# Altium project rad_detector_v500.PrjPcb
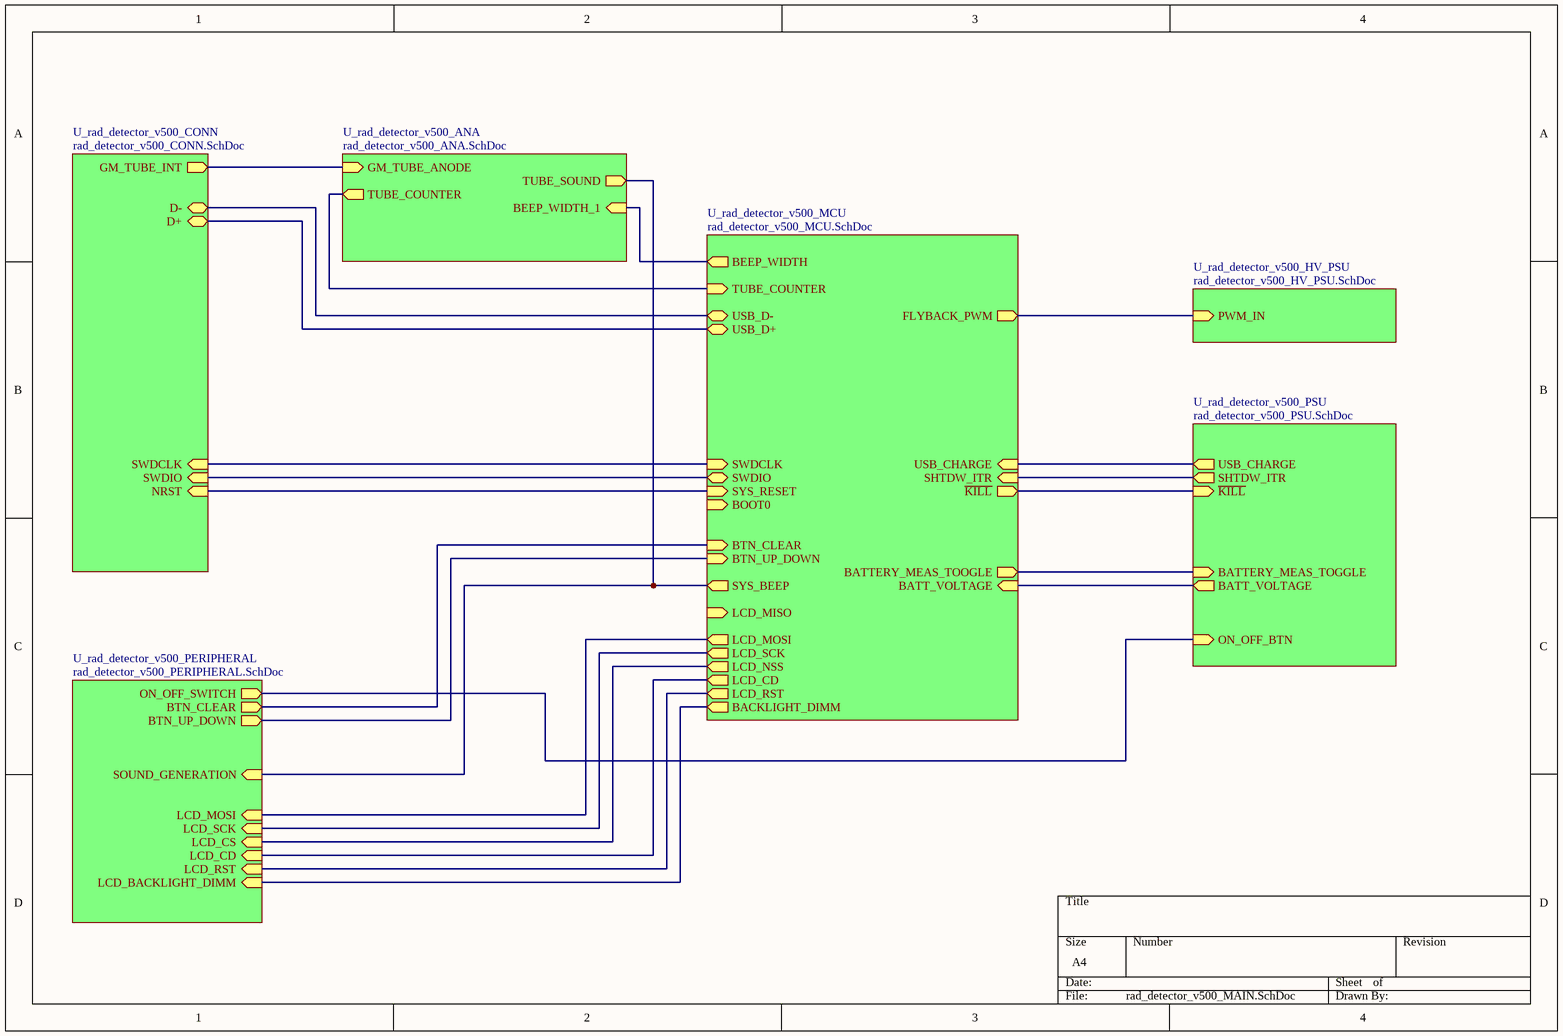
[diagram p0: rad_detector_v500_MAIN.SchDoc]
7 sheets, 104 parts. Net scope: hierarchical (ports join the sheet entries above them; power ports are global).
Board file: rad_detector_v500.PcbDoc
Sheets:
  rad_detector_v500_MAIN.SchDoc
    U_rad_detector_v500_CONN = rad_detector_v500_CONN.SchDoc
    U_rad_detector_v500_PERIPHERAL = rad_detector_v500_PERIPHERAL.SchDoc
    U_rad_detector_v500_ANA = rad_detector_v500_ANA.SchDoc
    U_rad_detector_v500_HV_PSU = rad_detector_v500_HV_PSU.SchDoc
    U_rad_detector_v500_PSU = rad_detector_v500_PSU.SchDoc
    U_rad_detector_v500_MCU = rad_detector_v500_MCU.SchDoc

## Sheet rad_detector_v500_MAIN.SchDoc
size A4; SheetNumber: 1; SheetTotal: 7

### Sub-sheets
U_rad_detector_v500_ANA = rad_detector_v500_ANA.SchDoc: GM_TUBE_ANODE (in), BEEP_WIDTH_1 (in), TUBE_COUNTER (out), TUBE_SOUND (out)
U_rad_detector_v500_CONN = rad_detector_v500_CONN.SchDoc: GM_TUBE_INT (out), D- (bidir), D+ (bidir), NRST (in), SWDCLK (in), SWDIO (in)
U_rad_detector_v500_HV_PSU = rad_detector_v500_HV_PSU.SchDoc: PWM_IN (in)
U_rad_detector_v500_MCU = rad_detector_v500_MCU.SchDoc: SYS_BEEP (out), BOOT0 (in), SYS_RESET (in), SWDIO (bidir), SWDCLK (in), USB_CHARGE (in), BATTERY_MEAS_TOOGLE (out), FLYBACK_PWM (out), SHTDW_ITR (in), TUBE_COUNTER (in), BACKLIGHT_DIMM (out), LCD_RST (out), LCD_MOSI (out), LCD_MISO (in), LCD_SCK (out), LCD_NSS (out), USB_D- (bidir), USB_D+ (bidir), BTN_CLEAR (in), BTN_UP_DOWN (in), BATT_VOLTAGE (in), BEEP_WIDTH (out), ~{KILL} (out), LCD_CD (out)
U_rad_detector_v500_PERIPHERAL = rad_detector_v500_PERIPHERAL.SchDoc: SOUND_GENERATION (in), LCD_BACKLIGHT_DIMM (in), LCD_MOSI (in), LCD_SCK (in), LCD_CS (in), LCD_CD (in), LCD_RST (in), ON_OFF_SWITCH (out), BTN_CLEAR (out), BTN_UP_DOWN (out)
U_rad_detector_v500_PSU = rad_detector_v500_PSU.SchDoc: ON_OFF_BTN (in), SHTDW_ITR (out), USB_CHARGE (out), BATTERY_MEAS_TOGGLE (in), BATT_VOLTAGE (out), ~{KILL} (in)

### Nets
BACKLIGHT_DIMM: sheet U_rad_detector_v500_PERIPHERAL/LCD_BACKLIGHT_DIMM, sheet U_rad_detector_v500_MCU/BACKLIGHT_DIMM
BTN_CLEAR: sheet U_rad_detector_v500_PERIPHERAL/BTN_CLEAR, sheet U_rad_detector_v500_MCU/BTN_CLEAR
BTN_UP_DOWN: sheet U_rad_detector_v500_PERIPHERAL/BTN_UP_DOWN, sheet U_rad_detector_v500_MCU/BTN_UP_DOWN
LCD_CD: sheet U_rad_detector_v500_PERIPHERAL/LCD_CD, sheet U_rad_detector_v500_MCU/LCD_CD
LCD_CS: sheet U_rad_detector_v500_PERIPHERAL/LCD_CS, sheet U_rad_detector_v500_MCU/LCD_NSS
LCD_MOSI: sheet U_rad_detector_v500_PERIPHERAL/LCD_MOSI, sheet U_rad_detector_v500_MCU/LCD_MOSI
LCD_RST: sheet U_rad_detector_v500_PERIPHERAL/LCD_RST, sheet U_rad_detector_v500_MCU/LCD_RST
LCD_SCK: sheet U_rad_detector_v500_PERIPHERAL/LCD_SCK, sheet U_rad_detector_v500_MCU/LCD_SCK
ON_OFF: sheet U_rad_detector_v500_PERIPHERAL/ON_OFF_SWITCH, sheet U_rad_detector_v500_PSU/ON_OFF_BTN
SWDCLK: sheet U_rad_detector_v500_CONN/SWDCLK, sheet U_rad_detector_v500_MCU/SWDCLK
SWDIO: sheet U_rad_detector_v500_CONN/SWDIO, sheet U_rad_detector_v500_MCU/SWDIO
SYS_RESET: sheet U_rad_detector_v500_CONN/NRST, sheet U_rad_detector_v500_MCU/SYS_RESET
USB_D+: sheet U_rad_detector_v500_CONN/D+, sheet U_rad_detector_v500_MCU/USB_D+
USB_D-: sheet U_rad_detector_v500_CONN/D-, sheet U_rad_detector_v500_MCU/USB_D-
NetC31_1: sheet U_rad_detector_v500_CONN/GM_TUBE_INT, sheet U_rad_detector_v500_ANA/GM_TUBE_ANODE
NetD4_1: sheet U_rad_detector_v500_PERIPHERAL/SOUND_GENERATION, sheet U_rad_detector_v500_ANA/TUBE_SOUND, sheet U_rad_detector_v500_MCU/SYS_BEEP
NetR7_2: sheet U_rad_detector_v500_HV_PSU/PWM_IN, sheet U_rad_detector_v500_MCU/FLYBACK_PWM
NetR11_1: sheet U_rad_detector_v500_PSU/USB_CHARGE, sheet U_rad_detector_v500_MCU/USB_CHARGE
NetR15_1: sheet U_rad_detector_v500_PSU/BATT_VOLTAGE, sheet U_rad_detector_v500_MCU/BATT_VOLTAGE
NetR16_2: sheet U_rad_detector_v500_PSU/BATTERY_MEAS_TOGGLE, sheet U_rad_detector_v500_MCU/BATTERY_MEAS_TOOGLE
NetR18_1: sheet U_rad_detector_v500_PSU/SHTDW_ITR, sheet U_rad_detector_v500_MCU/SHTDW_ITR
NetR48_1: sheet U_rad_detector_v500_ANA/BEEP_WIDTH_1, sheet U_rad_detector_v500_MCU/BEEP_WIDTH
NetR58_2: sheet U_rad_detector_v500_ANA/TUBE_COUNTER, sheet U_rad_detector_v500_MCU/TUBE_COUNTER
NetU5_2: sheet U_rad_detector_v500_PSU/~{KILL}, sheet U_rad_detector_v500_MCU/~{KILL}

## Sheet rad_detector_v500_CONN.SchDoc
size A4; SheetNumber: 5; SheetTotal: 7
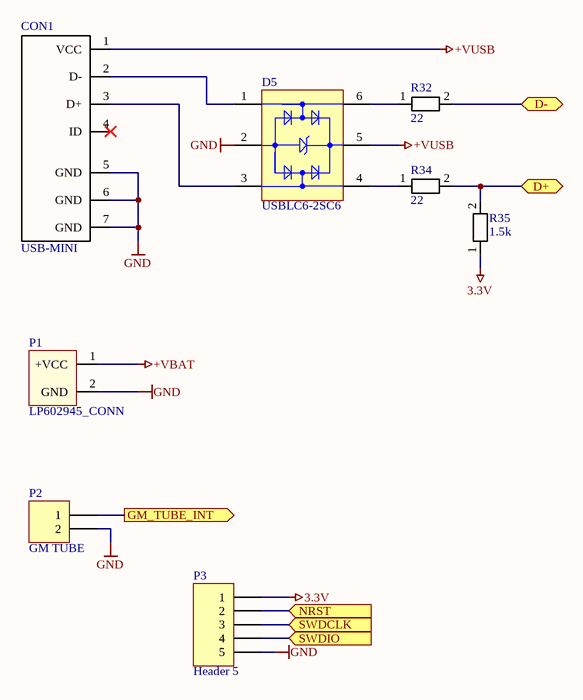
[diagram p1: rad_detector_v500_CONN.SchDoc]

### Parts
CON1  USB-MINI  [USB-MINI]
D5  USBLC6-2SC6  [STM-SOT23-6L_V]
P1  LP602945_CONN  [LP602945_CONN]
P2  GM TUBE  [HDR1X2]
P3  Header 5  [HDR1X5]
R32  22  [0805]
R34  22  [0805]
R35  1.5k  [0805]

### Ports
D+ (bidir, see rad_detector_v500_MAIN[1A]), D- (bidir, see rad_detector_v500_MAIN[1A]), GM_TUBE_INT (out, see rad_detector_v500_MAIN[1A]), NRST (in, see rad_detector_v500_MAIN[1B]), SWDCLK (in, see rad_detector_v500_MAIN[1B], rad_detector_v500_MCU[2C]), SWDIO (in, see rad_detector_v500_MAIN[1B], rad_detector_v500_MCU[2C])

### Nets
3.3V: P3.1 R35.1
+VBAT: P1.1(+VCC)
+VUSB: CON1.1(VCC) D5.5(VBUS)
GND: CON1.5(GND) CON1.6(GND) CON1.7(GND) D5.2(GND) P1.2(GND) P2.2 P3.5
SWDCLK: P3.3 ; port SWDCLK
SWDIO: P3.4 ; port SWDIO
SYS_RESET: P3.2 ; port NRST
USB_D+: R34.2 R35.2 ; port D+
USB_D-: R32.2 ; port D-
NetC31_1: P2.1 ; port GM_TUBE_INT
NetCON1_2: CON1.2(D-) D5.1(I/O_1)
NetCON1_3: CON1.3(D+) D5.3(I/O_2)
NetD5_4: D5.4(I/O_3) R34.1
NetD5_6: D5.6(I/O_4) R32.1

Not connected (* = marked no-connect by the designer): CON1 4(ID)*

### Library data of the parts
D5 = USBLC6-2SC6: Very low capacitance ESD protection, 3.5 pF, -40 to 125 degC, 6-Pin SOT23, RoHS, Tape and Reel; Manufacturer: STMicroelectronics; Polarity: Uni-Directional; Clamping Voltage: 17V; Rad Hardened: No; Product Height (mm): 1.3mm; Leakage Current (Max): 0.15uA; Product Length (mm): 3.05mm; Number of Elements: 1; Peak Pulse Current: 5A; Configuration: Dual; Reverse Breakdown Voltage: 6V; Working Voltage (Max): 5V; Capacitance Value: 3.5pF; Suppressor Type: DiodeArrays; Product Depth (mm): 1.75mm; Test Current (It): 1mA; Package / Case: SOT-23; Operating Temperature Max Deg. C: 125C; Package Description: 6-Pin Small Outline Transistor, Body 2.925 x 1.625 mm, Pitch 0.95 mm; Package Reference: SOT23-6L; Datasheet Version: Rev. 5, 10/2011; Operating Temperature Min Deg. C: -40C; Mounting Style: SurfaceMount; Direction Type: Uni-Directional; Mounting: SurfaceMount; Pin Count: 6; Leakage Current: 0.15uA; Packaging: TapeandReel; Operating Temperature Classification: Automotive; Clamping Voltage (Max): 17V; Manufacturer URL: http://www.st.com/; Reverse Stand-off Voltage: 5V; Datasheet URL: http://www.st.com/st-web-ui/static/active/en/resource/technical/document/datasheet/CD00050750.pdf; Working Voltage: 5V; Operating Temp Range: -40Cto125C
P2 = Header 2: Header, 2-Pin; LatestRevisionDate: 17-Jul-2002; LatestRevisionNote: Re-released for DXP Platform.; Publisher: Altium Limited
P3 = Header 5: Header, 5-Pin; LatestRevisionDate: 17-Jul-2002; LatestRevisionNote: Re-released for DXP Platform.; Publisher: Altium Limited
R32 R34 R35 = RESISTOR: Parameter 1: 10k

## Sheet rad_detector_v500_PERIPHERAL.SchDoc
size A4; SheetNumber: 6; SheetTotal: 7
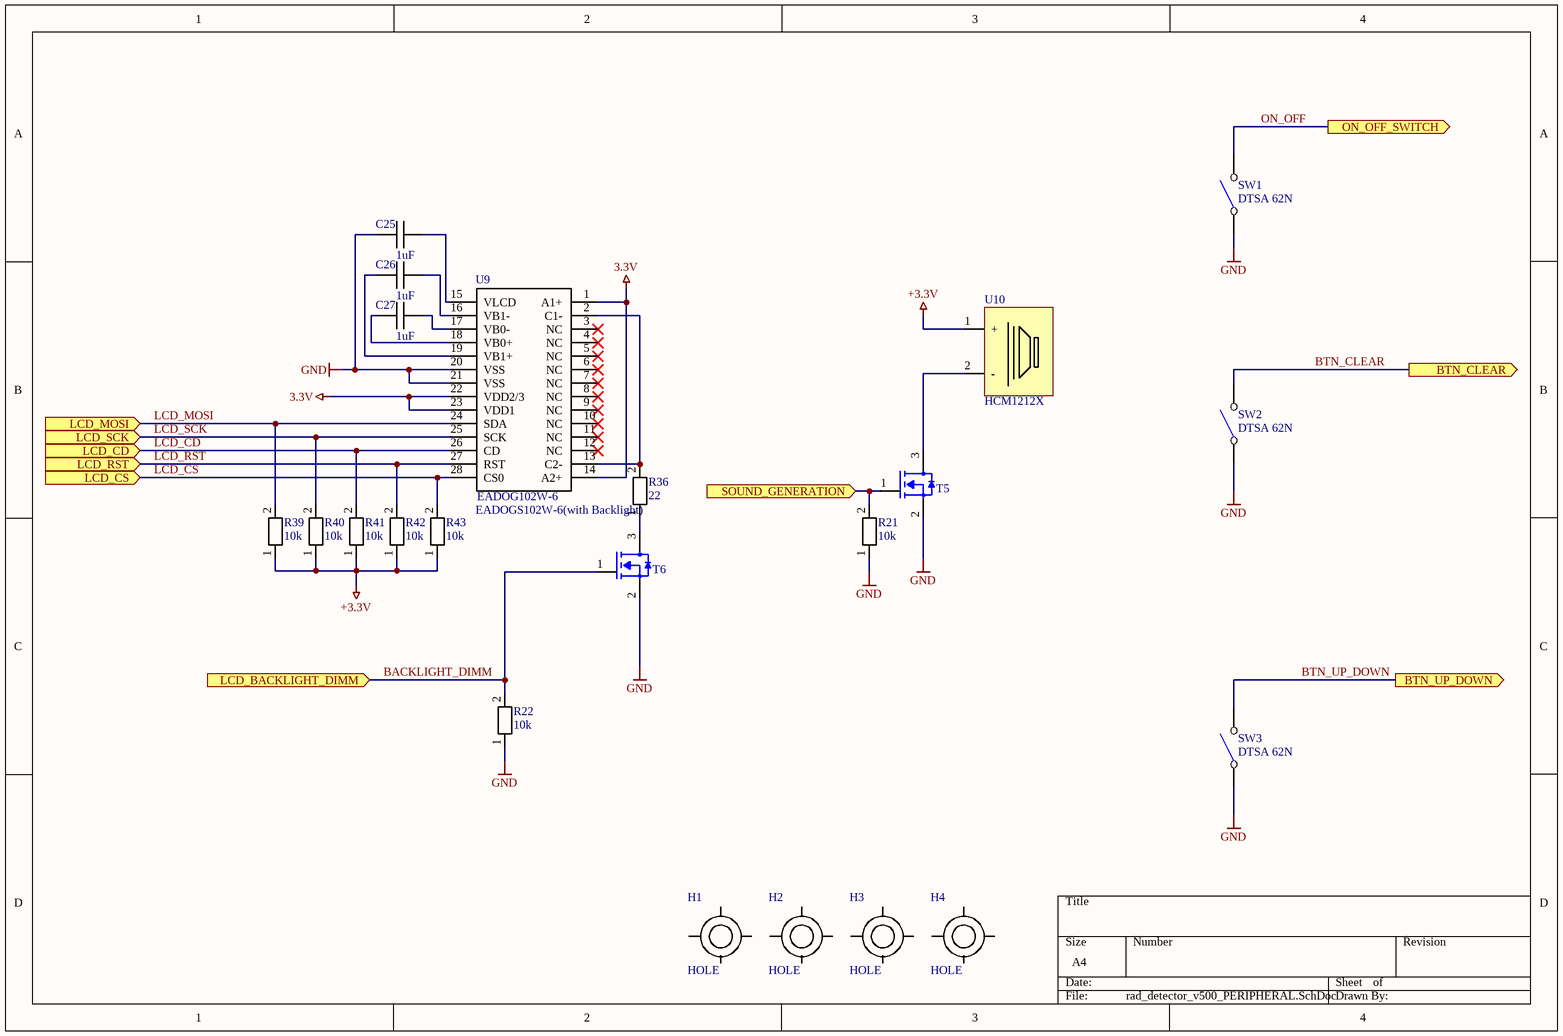
[diagram p2: rad_detector_v500_PERIPHERAL.SchDoc]

### Parts
C25  1uF  [0805_C]
C26  1uF  [0805_C]
C27  1uF  [0805_C]
H1  HOLE  [HOLE_140_160MIL]
H2  HOLE  [HOLE_140_160MIL]
H3  HOLE  [HOLE_140_160MIL]
H4  HOLE  [HOLE_140_160MIL]
R21  10k  [0805]
R22  10k  [0805]
R36  22  [1206]
R39  10k  [0805]
R40  10k  [0805]
R41  10k  [0805]
R42  10k  [0805]
R43  10k  [0805]
SW1  DTSA 62N  [SW_DTSA-62N]
SW2  DTSA 62N  [SW_DTSA-62N]
SW3  DTSA 62N  [SW_DTSA-62N]
T5  MMBF170  [SOT23]  (value not drawn)
T6  MMBF170  [SOT23]  (value not drawn)
U9  EADOGS102W-6(with Backlight)  [EADOGS102-6W]
U10  HCM1212X  [HCM1212X]

### Ports
BTN_CLEAR (out, see rad_detector_v500_MAIN[1C], rad_detector_v500_MCU[2B]), BTN_UP_DOWN (out, see rad_detector_v500_MAIN[1C], rad_detector_v500_MCU[2B]), LCD_BACKLIGHT_DIMM (in, see rad_detector_v500_MAIN[1D]), LCD_CD (in, see rad_detector_v500_MAIN[1D], rad_detector_v500_MCU[2C]), LCD_CS (in, see rad_detector_v500_MAIN[1D]), LCD_MOSI (in, see rad_detector_v500_MAIN[1D], rad_detector_v500_MCU[3C]), LCD_RST (in, see rad_detector_v500_MAIN[1D], rad_detector_v500_MCU[2C]), LCD_SCK (in, see rad_detector_v500_MAIN[1D], rad_detector_v500_MCU[3C]), ON_OFF_SWITCH (out, see rad_detector_v500_MAIN[1C]), SOUND_GENERATION (in, see rad_detector_v500_MAIN[1D])

### Nets
3.3V: U9.1(A1+) U9.14(A2+) U9.22(VDD2/3) U9.23(VDD1)
+3.3V: R39.1 R40.1 R41.1 R42.1 R43.1 U10.1(+)
GND: C25.1 R21.1 R22.1 SW1.1 SW2.1 SW3.1 T5.2(Source) T6.2(Source) U9.20(VSS) U9.21(VSS)
BACKLIGHT_DIMM: R22.2 T6.1(Gate) ; port LCD_BACKLIGHT_DIMM
BTN_CLEAR: SW2.2 ; port BTN_CLEAR
BTN_UP_DOWN: SW3.2 ; port BTN_UP_DOWN
LCD_CD: R41.2 U9.26(CD) ; port LCD_CD
LCD_CS: R43.2 U9.28(CS0) ; port LCD_CS
LCD_MOSI: R39.2 U9.24(SDA) ; port LCD_MOSI
LCD_RST: R42.2 U9.27(RST) ; port LCD_RST
LCD_SCK: R40.2 U9.25(SCK) ; port LCD_SCK
ON_OFF: SW1.2 ; port ON_OFF_SWITCH
NetC25_2: C25.2 U9.15(VLCD)
NetC26_1: C26.1 U9.19(VB1+)
NetC26_2: C26.2 U9.16(VB1-)
NetC27_1: C27.1 U9.18(VB0+)
NetC27_2: C27.2 U9.17(VB0-)
NetD4_1: R21.2 T5.1(Gate) ; port SOUND_GENERATION
NetR36_1: R36.1 T6.3(Drain)
NetR36_2: R36.2 U9.2(C1-) U9.13(C2-)
NetT5_3: T5.3(Drain) U10.2(-)

Not connected (* = marked no-connect by the designer): U9 3(NC)* 4(NC)* 5(NC)* 6(NC)* 7(NC)* 8(NC)* 9(NC)* 10(NC)* 11(NC)* 12(NC)*

### Notes on the sheet
- (in symbol EADOGS102W-6(with Backlight)) EADOG102W-6

### Library data of the parts
C25-C27 = CAPACITOR
R21 R22 R39-R43 = RESISTOR: Parameter 1: 10k
R36 = RESISTOR: Parameter 1: 10k
SW1-SW3 = SW_DTSA 62N
T5 T6 = MMBF170: N MOSFET

## Sheet rad_detector_v500_ANA.SchDoc
size A4; SheetNumber: 7; SheetTotal: 7
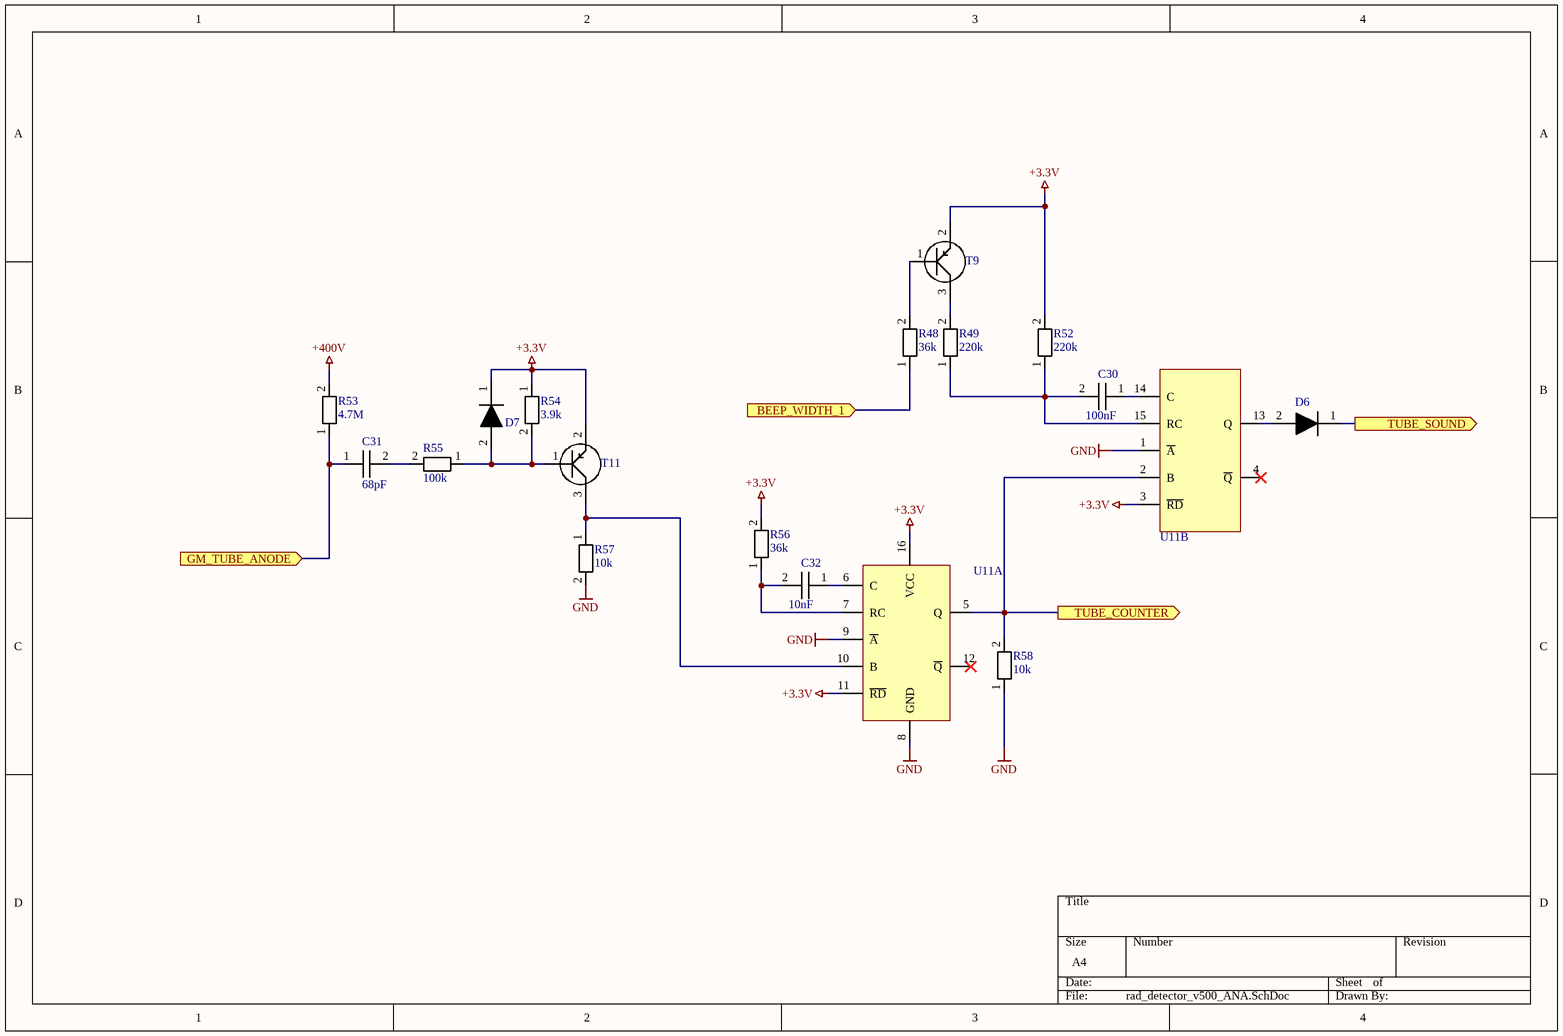
[diagram p3: rad_detector_v500_ANA.SchDoc]

### Parts
C30  100nF  [0805_C]
C31  68pF  [CAPACITOR_250MIL]
C32  10nF  [0805_C]
D6  DIODE  [SMD_DIODE_SOD80]  (value not drawn)
D7  DIODE  [SMD_DIODE_SOD80]  (value not drawn)
R48  36k  [0805]
R49  220k  [0805]
R52  220k  [0805]
R53  4.7M  [0805]
R54  3.9k  [0805]
R55  100k  [0805]
R56  36k  [0805]
R57  10k  [0805]
R58  10k  [0805]
T9  BC856  [SOT23]  (value not drawn)
T11  BC856  [SOT23]  (value not drawn)
U11  74HCT123  [74HCT123]  (value not drawn)  (parts A,B of 2)

### Ports
BEEP_WIDTH_1 (in, see rad_detector_v500_MAIN[2A]), GM_TUBE_ANODE (in, see rad_detector_v500_MAIN[1A]), TUBE_COUNTER (out, see rad_detector_v500_MAIN[1A], rad_detector_v500_MCU[2B]), TUBE_SOUND (out, see rad_detector_v500_MAIN[2A])

### Nets
+3.3V: D7.1 R52.2 R54.1 R56.2 T9.2 T11.2 U11.3(~{RD}) U11.11(~{RD}) U11.16(VCC)
+400V: R53.2
GND: R57.2 R58.1 U11.1(~{A}) U11.8(GND) U11.9(~{A})
NetC30_1: C30.1 U11.14(C)
NetC30_2: C30.2 R49.1 R52.1 U11.15(RC)
NetC31_1: C31.1 R53.1 ; port GM_TUBE_ANODE
NetC31_2: C31.2 R55.2
NetC32_1: C32.1 U11.6(C)
NetC32_2: C32.2 R56.1 U11.7(RC)
NetD4_1: D6.1 ; port TUBE_SOUND
NetD6_2: D6.2 U11.13(Q)
NetD7_2: D7.2 R54.2 R55.1 T11.1
NetR48_1: R48.1 ; port BEEP_WIDTH_1
NetR48_2: R48.2 T9.1
NetR49_2: R49.2 T9.3
NetR57_1: R57.1 T11.3 U11.10(B)
NetR58_2: R58.2 U11.2(B) U11.5(Q) ; port TUBE_COUNTER

Not connected (* = marked no-connect by the designer): U11 4(~{Q})* 12(~{Q})*

### Library data of the parts
C30-C32 = CAPACITOR
R48 R49 R52-R56 = RESISTOR: Parameter 1: 10k
R57 R58 = RESISTOR: Parameter 1: 10k
T9 T11 = TRANSISTOR_PNP

## Sheet rad_detector_v500_HV_PSU.SchDoc
size A4; SheetNumber: 2; SheetTotal: 7
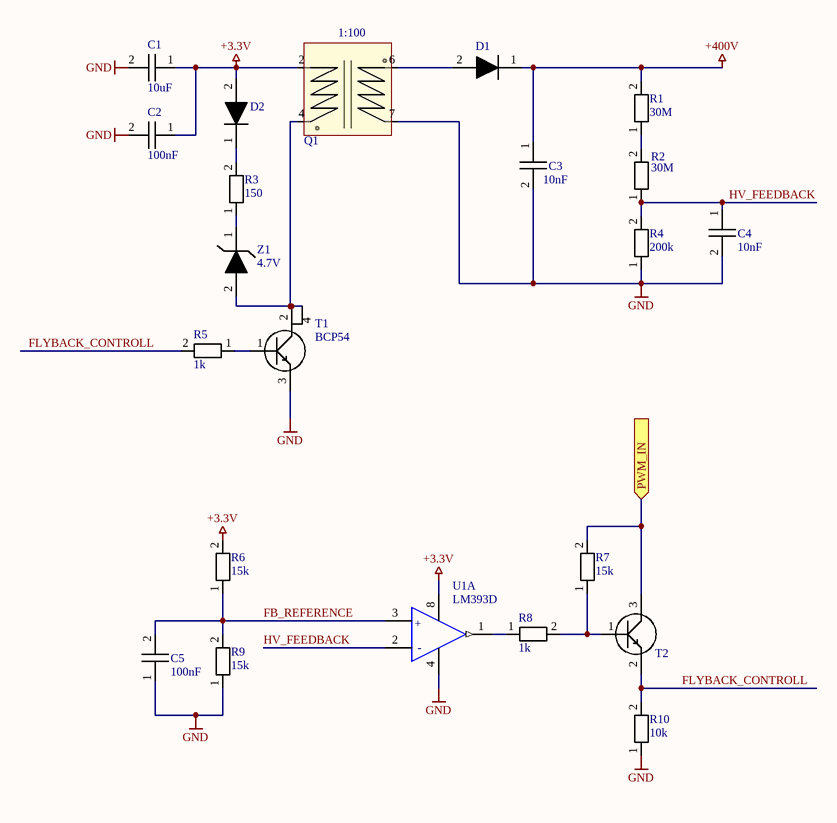
[diagram p4: rad_detector_v500_HV_PSU.SchDoc]

### Parts
C1  10uF  [1210_C]
C2  100nF  [0805_C]
C3  10nF  [CAPACITOR_300MIL]
C4  10nF  [0805_C]
C5  100nF  [0805_C]
D1  DIODE  [DIODE_400MIL]  (value not drawn)
D2  DIODE  [SMD_DIODE_SOD80]  (value not drawn)
Q1  DARFON_CCFL_TRANSFORMER  [DARFON_CCFL_TRANSFORMER]  (value not drawn)
R1  30M  [0805]
R2  30M  [0805]
R3  150  [0805]
R4  200k  [0805]
R5  1k  [0805]
R6  15k  [0805]
R7  15k  [0805]
R8  1k  [0805]
R9  15k  [0805]
R10  10k  [0805]
T1  BCP54  [SOT233-1]
T2  BC848*  [SOT23]  (value not drawn)
U1  LM393D  [SO-8]  (part A of 2)
Z1  4.7V  [SMD_DIODE_SOD80]

### Ports
PWM_IN (in, see rad_detector_v500_MAIN[4B])

### Nets
+3.3V: C1.1 C2.1 D2.2 Q1.2 R6.2 U1.8(Vcc+)
+400V: C3.1 D1.1 R1.2
GND: C1.2 C2.2 C3.2 C4.2 C5.1 Q1.7 R4.1 R9.1 R10.1 T1.3 U1.4(Vcc-)
FB_REFERENCE: C5.2 R6.1 R9.2 U1.3(In1+)
FLYBACK_CONTROLL: R5.2 R10.2 T2.2
HV_FEEDBACK: C4.1 R2.1 R4.2 U1.2(In1-)
NetD1_2: D1.2 Q1.6
NetD2_1: D2.1 R3.2
NetQ1_4: Q1.4 T1.2 T1.4 Z1.2
NetR1_1: R1.1 R2.2
NetR3_1: R3.1 Z1.1
NetR5_1: R5.1 T1.1
NetR7_1: R7.1 R8.2 T2.1
NetR7_2: R7.2 T2.3 ; port PWM_IN
NetR8_1: R8.1 U1.1(Out1)

### Notes on the sheet
- (in symbol DARFON_CCFL_TRANSFORMER) 1:100
- (in symbol LM393D, part A) +; -

### Library data of the parts
C1-C5 = CAPACITOR
R1-R9 = RESISTOR: Parameter 1: 10k
R10 = RESISTOR: Parameter 1: 10k
T2 = TRANSISTOR_NPN
U1 = LM393D: IC VOLT COMPARATOR DUAL LP 8SOIC; Manufacturer: STMicroelectronics; Response Time: 1.3us; Min Supply Voltage: 2V; Input Offset Voltage: 1mV; Input Bias Current: 0.02uA; Max Dual Supply Voltage: 18V; Output Current Per Channel: 18mA; Max Junction Temp: +150°C; Standoff Height: 0.1mm; Number Of Channels: 2; Nominal Supply Current: 0.45-0.6mA; Voltage Gain: 200V/mV; Max Supply Voltage: 36V; Min Dual Supply Voltage: 1V; Ambient Temperature Range Low: 0°C; ComponentLink2Description: Datasheet; Lead Free: Yes; Device Class L3: Comparators; Device Class L2: Linear ICs; Manufacturer Part Number: LM393D; Digikey Description: IC VOLT COMPARATOR DUAL LP 8SOIC; Category: IC; Octopart: https://octopart.com/lm393d-stmicroelectronics-25832; Package: SO8; RoHS: TRUE; Footprint Url: https://www.st.com/resource/en/datasheet/stm8l001j3.pdf; Temperature Range Low: 0°C; Temperature Range High: +70°C; Mouser Description: Analog Comparators Lo-Pwr Dual Voltage; ComponentLink2URL: https://www.st.com/resource/en/datasheet/lm393.pdf; Automotive: No; Temperature: 0°C to +70°C; Height: 1.75mm; Device Class L1: Integrated Circuits (ICs); Ambient Temperature Range High: +70°C
Z1 = DIODE_ZENER

## Sheet rad_detector_v500_PSU.SchDoc
size A4; SheetNumber: 3; SheetTotal: 7
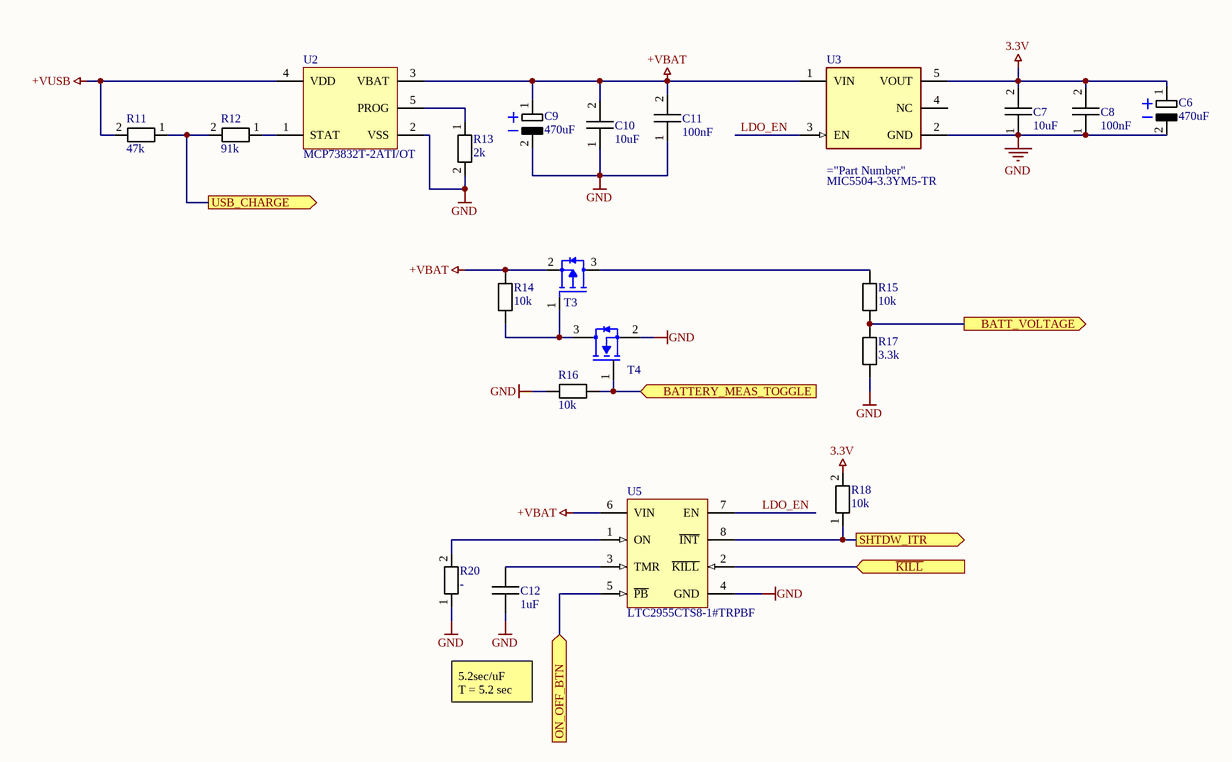
[diagram p5: rad_detector_v500_PSU.SchDoc]

### Parts
C6  470uF  [CAPAE9383X110M]
C7  10uF  [1210_C]
C8  100nF  [0805_C]
C9  470uF  [CAPAE9383X110M]
C10  10uF  [1210_C]
C11  100nF  [0805_C]
C12  1uF  [0805_C]
R11  47k  [0805]
R12  91k  [0805]
R13  2k  [0805]
R14  10k  [0805]
R15  10k  [0805]
R16  10k  [0805]
R17  3.3k  [0805]
R18  10k  [0805]
R20  -  [0805]
T3  BSS84  [SOT23]  (value not drawn)
T4  MMBF170  [SOT23]  (value not drawn)
U2  MCP73832T-2ATI/OT  [SOT23-5]
U3  MIC5504-3.3YM5-TR  [SOT23-5]
U5  LTC2955CTS8-1#TRPBF  [LT-TS8-8-TSOT-23_V]

### Ports
BATT_VOLTAGE (out, see rad_detector_v500_MAIN[4C], rad_detector_v500_MCU[2B]), BATTERY_MEAS_TOGGLE (in, see rad_detector_v500_MAIN[4C]), ON_OFF_BTN (in, see rad_detector_v500_MAIN[4C]), SHTDW_ITR (out, see rad_detector_v500_MAIN[4B], rad_detector_v500_MCU[2B]), USB_CHARGE (out, see rad_detector_v500_MAIN[4B], rad_detector_v500_MCU[3B]), ~{KILL} (in, see rad_detector_v500_MAIN[4B], rad_detector_v500_MCU[3B])

### Nets
3.3V: C6.1 C7.2 C8.2 R18.2 U3.5(VOUT)
+VBAT: C9.1 C10.2 C11.2 R14.2 T3.2(S) U2.3(VBAT) U3.1(VIN) U5.6(VIN)
+VUSB: R11.2 U2.4(VDD)
GND: C6.2 C7.1 C8.1 C9.2 C10.1 C11.1 C12.2 R13.2 R16.1 R17.1 R20.1 T4.2(Source) U2.2(VSS) U3.2(GND) U5.4(GND)
LDO_EN: U3.3(EN) U5.7(EN)
ON_OFF: U5.5(~{PB}) ; port ON_OFF_BTN
NetC12_1: C12.1 U5.3(TMR)
NetR11_1: R11.1 R12.2 ; port USB_CHARGE
NetR12_1: R12.1 U2.1(STAT)
NetR13_1: R13.1 U2.5(PROG)
NetR14_1: R14.1 T3.1(G) T4.3(Drain)
NetR15_1: R15.1 R17.2 ; port BATT_VOLTAGE
NetR15_2: R15.2 T3.3(D)
NetR16_2: R16.2 T4.1(Gate) ; port BATTERY_MEAS_TOGGLE
NetR18_1: R18.1 U5.8(~{INT}) ; port SHTDW_ITR
NetR20_2: R20.2 U5.1(ON)
NetU5_2: U5.2(~{KILL}) ; port ~{KILL}

Not connected (* = marked no-connect by the designer): U3 4(NC)

### Notes on the sheet
- 5.2sec/uF
  T = 5.2 sec

### Library data of the parts
C6 C9 = CAPACITOR_ELCO
C7 C8 C10-C12 = CAPACITOR
R11-R13 R17 R20 = RESISTOR: Parameter 1: 10k
R14-R16 R18 = RESISTOR: Parameter 1: 10k
T3 = BSS84: P-Chanel MOSFET
T4 = MMBF170: N MOSFET
U2 = MCP73832T-2ATI/OT: Miniature Single-Cell, Fully Integrated Li-Ion, Li-Polymer Charge Management Controller, 4.2V, 5-Pin SOT-23, Industrial Temperature, Tape and Reel
U5 = LTC2955CTS8-1: Pushbutton On / Off Controller with Automatic Turn-On, 8-pin SOT23 (TS8-8), 0 to 70 degC, Pb-Free, Tape and Reel

## Sheet rad_detector_v500_MCU.SchDoc
size A4; SheetNumber: 4; SheetTotal: 7
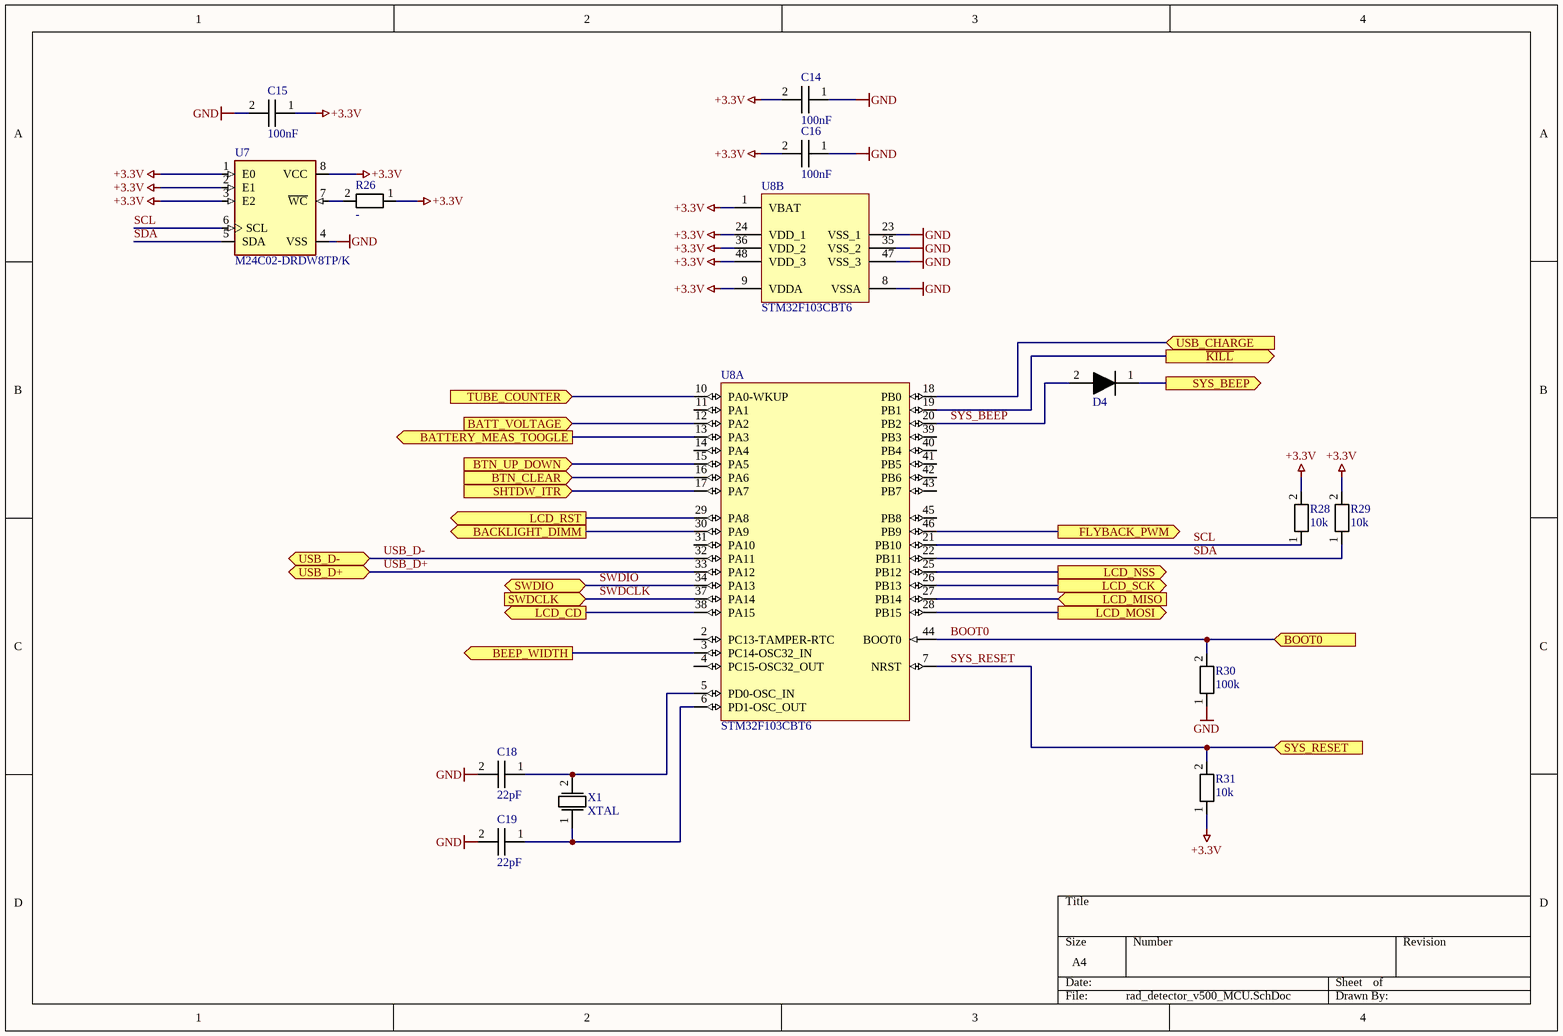
[diagram p6: rad_detector_v500_MCU.SchDoc]

### Parts
C14  100nF  [0805_C]
C15  100nF  [0805_C]
C16  100nF  [0805_C]
C18  22pF  [0805_C]
C19  22pF  [0805_C]
D4  DIODE  [SMD_DIODE_SOD80]  (value not drawn)
R26  -  [0805]
R28  10k  [0805]
R29  10k  [0805]
R30  100k  [0805]
R31  10k  [0805]
U7  M24C02-DRDW8TP/K  [TSSOP8]
U8  STM32F103CBT6  [STM-LQFP48_N]  (parts A,B of 2)
X1  XTAL  [XTAL_SMD]

### Ports
BACKLIGHT_DIMM (out, see rad_detector_v500_MAIN[2C]), BATT_VOLTAGE (in, see rad_detector_v500_MAIN[3C], rad_detector_v500_PSU[3B]), BATTERY_MEAS_TOOGLE (out, see rad_detector_v500_MAIN[3C]), BEEP_WIDTH (out, see rad_detector_v500_MAIN[2B]), BOOT0 (in, see rad_detector_v500_MAIN[2B]), BTN_CLEAR (in, see rad_detector_v500_MAIN[2C], rad_detector_v500_PERIPHERAL[4B]), BTN_UP_DOWN (in, see rad_detector_v500_MAIN[2C], rad_detector_v500_PERIPHERAL[4C]), FLYBACK_PWM (out, see rad_detector_v500_MAIN[3B]), LCD_CD (out, see rad_detector_v500_MAIN[2C], rad_detector_v500_PERIPHERAL[1B]), LCD_MISO (in, see rad_detector_v500_MAIN[2C]), LCD_MOSI (out, see rad_detector_v500_MAIN[2C], rad_detector_v500_PERIPHERAL[1B]), LCD_NSS (out, see rad_detector_v500_MAIN[2C]), LCD_RST (out, see rad_detector_v500_MAIN[2C], rad_detector_v500_PERIPHERAL[1B]), LCD_SCK (out, see rad_detector_v500_MAIN[2C], rad_detector_v500_PERIPHERAL[1B]), SHTDW_ITR (in, see rad_detector_v500_MAIN[3B], rad_detector_v500_PSU[3C]), SWDCLK (in, see rad_detector_v500_MAIN[2B], rad_detector_v500_CONN[3C]), SWDIO (bidir, see rad_detector_v500_MAIN[2B], rad_detector_v500_CONN[3C]), SYS_BEEP (out, see rad_detector_v500_MAIN[2C]), SYS_RESET (in, see rad_detector_v500_MAIN[2B]), TUBE_COUNTER (in, see rad_detector_v500_MAIN[2B], rad_detector_v500_ANA[3C]), USB_CHARGE (in, see rad_detector_v500_MAIN[3B], rad_detector_v500_PSU[1B]), USB_D+ (bidir, see rad_detector_v500_MAIN[2B]), USB_D- (bidir, see rad_detector_v500_MAIN[2B]), ~{KILL} (out, see rad_detector_v500_MAIN[3B], rad_detector_v500_PSU[3C])

### Nets
+3.3V: C14.2 C15.1 C16.2 R26.1 R28.2 R29.2 R31.1 U7.1(E0) U7.2(E1) U7.3(E2) U7.8(VCC) U8.1(VBAT) U8.9(VDDA) U8.24(VDD_1) U8.36(VDD_2) U8.48(VDD_3)
GND: C14.1 C15.2 C16.1 C18.2 C19.2 R30.1 U7.4(VSS) U8.8(VSSA) U8.23(VSS_1) U8.35(VSS_2) U8.47(VSS_3)
BACKLIGHT_DIMM: U8.30(PA9) ; port BACKLIGHT_DIMM
BOOT0: R30.2 U8.44(BOOT0) ; port BOOT0
BTN_CLEAR: U8.16(PA6) ; port BTN_CLEAR
BTN_UP_DOWN: U8.15(PA5) ; port BTN_UP_DOWN
LCD_CD: U8.38(PA15) ; port LCD_CD
LCD_CS: U8.25(PB12) ; port LCD_NSS
LCD_MOSI: U8.28(PB15) ; port LCD_MOSI
LCD_RST: U8.29(PA8) ; port LCD_RST
LCD_SCK: U8.26(PB13) ; port LCD_SCK
SCL: R28.1 U7.6(SCL) U8.21(PB10)
SDA: R29.1 U7.5(SDA) U8.22(PB11)
SWDCLK: U8.37(PA14) ; port SWDCLK
SWDIO: U8.34(PA13) ; port SWDIO
SYS_BEEP: D4.2 U8.20(PB2)
SYS_RESET: R31.2 U8.7(NRST) ; port SYS_RESET
USB_D+: U8.33(PA12) ; port USB_D+
USB_D-: U8.32(PA11) ; port USB_D-
NetC18_1: C18.1 U8.5(PD0-OSC_IN) X1.2
NetC19_1: C19.1 U8.6(PD1-OSC_OUT) X1.1
NetD4_1: D4.1 ; port SYS_BEEP
NetR7_2: U8.46(PB9) ; port FLYBACK_PWM
NetR11_1: U8.18(PB0) ; port USB_CHARGE
NetR15_1: U8.12(PA2) ; port BATT_VOLTAGE
NetR16_2: U8.13(PA3) ; port BATTERY_MEAS_TOOGLE
NetR18_1: U8.17(PA7) ; port SHTDW_ITR
NetR26_2: R26.2 U7.7(~{WC})
NetR48_1: U8.3(PC14-OSC32_IN) ; port BEEP_WIDTH
NetR58_2: U8.10(PA0-WKUP) ; port TUBE_COUNTER
NetU5_2: U8.19(PB1) ; port ~{KILL}
NetU8_27: U8.27(PB14) ; port LCD_MISO

Not connected (* = marked no-connect by the designer): U8 2(PC13-TAMPER-RTC) 4(PC15-OSC32_OUT) 11(PA1) 14(PA4) 31(PA10) 39(PB3) 40(PB4) 41(PB5) 42(PB6) 43(PB7) 45(PB8)

### Library data of the parts
C14-C16 C18 C19 = CAPACITOR
R26 R30 = RESISTOR: Parameter 1: 10k
R28 R29 R31 = RESISTOR: Parameter 1: 10k
U7 = M24C02-FDW6TP: EEPROM Memory IC 2Kb (256 x 8) I2C 400kHz 900ns 8-TSSOP; MF: STMicroelectronics; Package: TSSOP-8 STMicroelectronics; MP: M24C02-FDW6TP; Digi-Key_Part_Number: 497-15746-1-ND; Value: *; SnapEDA_Link: https://www.snapeda.com/parts/M24C02-FDW6TP/STMicroelectronics/view-part/1102461/?ref=snap
U8 = STM32F103CBT6: ARM Cortex-M3 32-bit MCU, 128 KB Flash, 20 KB Internal RAM, 37 I/Os, 48-pin LQFP, -40 to 85 degC, Tray; Supply Voltage(Vcc) min (V): 2; Operating Frequency(F) (Processor speed) (MHz): 72; A/D Converter: 2x12-bit (10 Channel); FLASH Size (Prog) (kB): 128; Internal RAM Size (kB): 20; I/Os (High Current): 37; ComponentLink2Description: Datasheet; PackageReference: LQFP48; PartNumber: STM32F103CBT6; ComponentLink1Description: Manufacturer URL; DatasheetVersion: Rev. 16; PackageVersion: Rev. 6, 06/2013; Packing: Tray; ComponentLink1URL: http://www.st.com/web/en/home.html; Mounting Technology: Surface Mount; ComponentLink3URL: http://www.st.com/st-web-ui/static/active/en/resource/technical/document/datasheet/DM00058181.pdf; PackageDescription: 48-Pin Low Profile Quad Flat Package, 7 x 7 mm Body, 0.5 mm Pitch; Core: ARM Cortex-M3; ComponentLink3Description: Package Specification; ComponentLink2URL: http://www.st.com/st-web-ui/static/active/en/resource/technical/document/datasheet/CD00161566.pdf

## Nets that join several sheets
3.3V: rad_detector_v500_CONN (P3.1 R35.1), rad_detector_v500_PERIPHERAL (U9.1 U9.14 U9.22 U9.23), rad_detector_v500_PSU (5 pins)
+3.3V: rad_detector_v500_PERIPHERAL (6 pins), rad_detector_v500_ANA (9 pins), rad_detector_v500_HV_PSU (6 pins), rad_detector_v500_MCU (16 pins)
+400V: rad_detector_v500_ANA (R53.2), rad_detector_v500_HV_PSU (C3.1 D1.1 R1.2)
+VBAT: rad_detector_v500_CONN (P1.1), rad_detector_v500_PSU (8 pins)
+VUSB: rad_detector_v500_CONN (CON1.1 D5.5), rad_detector_v500_PSU (R11.2 U2.4)
GND: rad_detector_v500_CONN (7 pins), rad_detector_v500_PERIPHERAL (10 pins), rad_detector_v500_ANA (5 pins), rad_detector_v500_HV_PSU (11 pins), rad_detector_v500_PSU (15 pins), rad_detector_v500_MCU (11 pins)
BACKLIGHT_DIMM: rad_detector_v500_PERIPHERAL (R22.2 T6.1), rad_detector_v500_MCU (U8.30)
BTN_CLEAR: rad_detector_v500_PERIPHERAL (SW2.2), rad_detector_v500_MCU (U8.16)
BTN_UP_DOWN: rad_detector_v500_PERIPHERAL (SW3.2), rad_detector_v500_MCU (U8.15)
LCD_CD: rad_detector_v500_PERIPHERAL (R41.2 U9.26), rad_detector_v500_MCU (U8.38)
LCD_CS: rad_detector_v500_PERIPHERAL (R43.2 U9.28), rad_detector_v500_MCU (U8.25)
LCD_MOSI: rad_detector_v500_PERIPHERAL (R39.2 U9.24), rad_detector_v500_MCU (U8.28)
LCD_RST: rad_detector_v500_PERIPHERAL (R42.2 U9.27), rad_detector_v500_MCU (U8.29)
LCD_SCK: rad_detector_v500_PERIPHERAL (R40.2 U9.25), rad_detector_v500_MCU (U8.26)
NetC31_1: rad_detector_v500_CONN (P2.1), rad_detector_v500_ANA (C31.1 R53.1)
NetD4_1: rad_detector_v500_PERIPHERAL (R21.2 T5.1), rad_detector_v500_ANA (D6.1), rad_detector_v500_MCU (D4.1)
NetR7_2: rad_detector_v500_HV_PSU (R7.2 T2.3), rad_detector_v500_MCU (U8.46)
NetR11_1: rad_detector_v500_PSU (R11.1 R12.2), rad_detector_v500_MCU (U8.18)
NetR15_1: rad_detector_v500_PSU (R15.1 R17.2), rad_detector_v500_MCU (U8.12)
NetR16_2: rad_detector_v500_PSU (R16.2 T4.1), rad_detector_v500_MCU (U8.13)
NetR18_1: rad_detector_v500_PSU (R18.1 U5.8), rad_detector_v500_MCU (U8.17)
NetR48_1: rad_detector_v500_ANA (R48.1), rad_detector_v500_MCU (U8.3)
NetR58_2: rad_detector_v500_ANA (R58.2 U11.2 U11.5), rad_detector_v500_MCU (U8.10)
NetU5_2: rad_detector_v500_PSU (U5.2), rad_detector_v500_MCU (U8.19)
ON_OFF: rad_detector_v500_PERIPHERAL (SW1.2), rad_detector_v500_PSU (U5.5)
SWDCLK: rad_detector_v500_CONN (P3.3), rad_detector_v500_MCU (U8.37)
SWDIO: rad_detector_v500_CONN (P3.4), rad_detector_v500_MCU (U8.34)
SYS_RESET: rad_detector_v500_CONN (P3.2), rad_detector_v500_MCU (R31.2 U8.7)
USB_D+: rad_detector_v500_CONN (R34.2 R35.2), rad_detector_v500_MCU (U8.33)
USB_D-: rad_detector_v500_CONN (R32.2), rad_detector_v500_MCU (U8.32)